# EAGLE schematic m220pal (EAGLE 4.11)
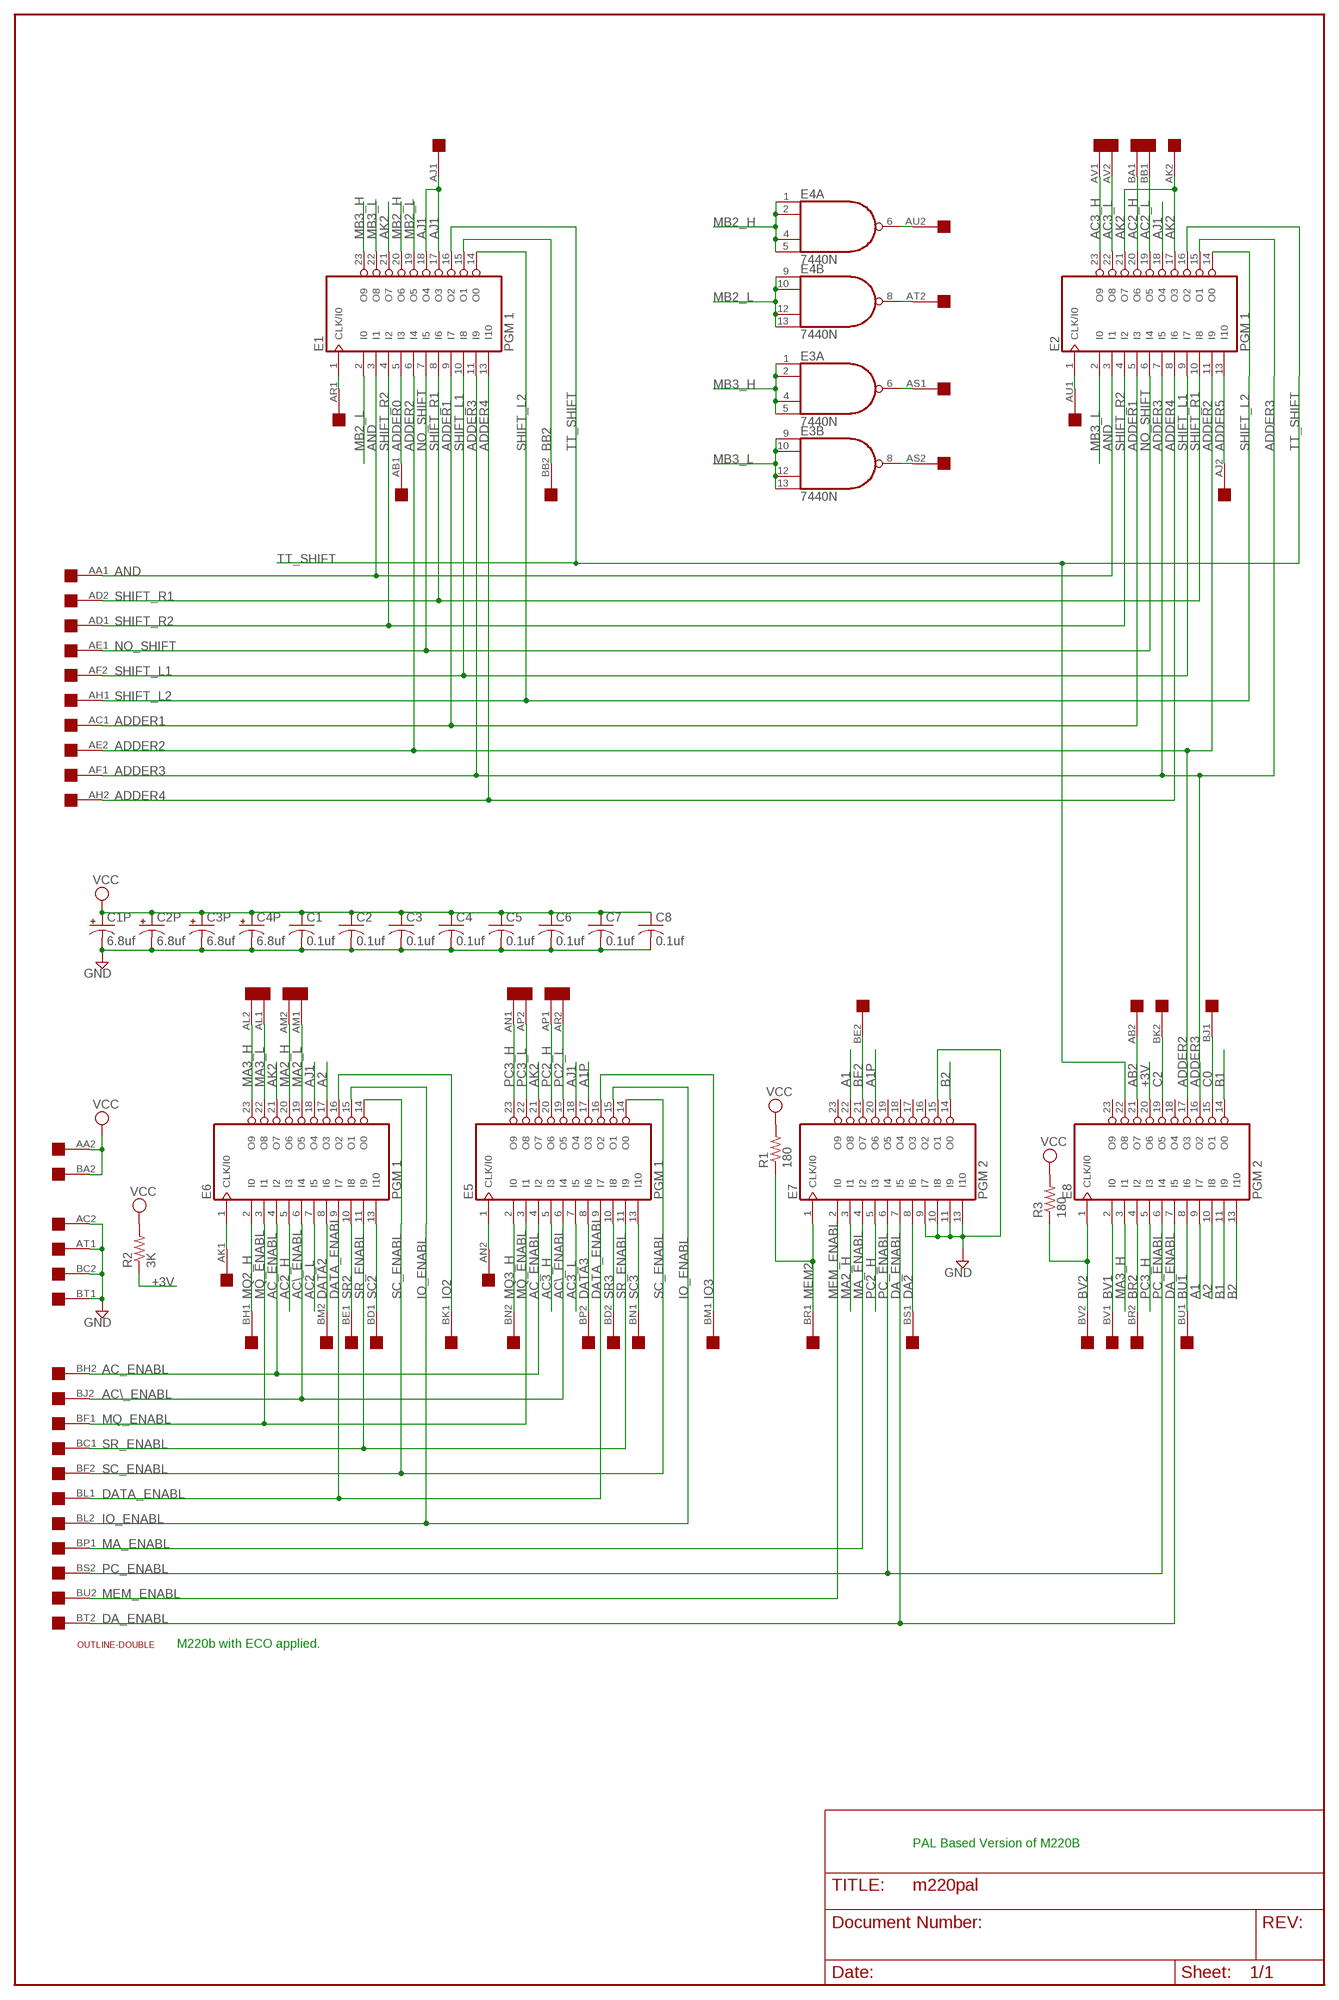
[diagram p0: schematic, sheet 1]

## Parts
C1  0.1uf  C-US050-025X075  [C050-025X075]
C1P  6.8uf  CPOL-USE15-5AXIAL  [E15-5]
C2  0.1uf  C-US050-025X075  [C050-025X075]
C2P  6.8uf  CPOL-USE15-5AXIAL  [E15-5]
C3  0.1uf  C-US050-025X075  [C050-025X075]
C3P  6.8uf  CPOL-USE15-5AXIAL  [E15-5]
C4  0.1uf  C-US050-025X075  [C050-025X075]
C4P  6.8uf  CPOL-USE15-5AXIAL  [E15-5]
C5  0.1uf  C-US050-025X075  [C050-025X075]
C6  0.1uf  C-US050-025X075  [C050-025X075]
C7  0.1uf  C-US050-025X075  [C050-025X075]
C8  0.1uf  C-US050-025X075  [C050-025X075]
E1  PGM 1  22V10  [DIL24-3]
E2  PGM 1  22V10  [DIL24-3]
E3  7440N  74S20N  [DIL14]
E4  7440N  74S20N  [DIL14]
E5  PGM 1  22V10  [DIL24-3]
E6  PGM 1  22V10  [DIL24-3]
E7  PGM 2  22V10  [DIL24-3]
E8  PGM 2  22V10  [DIL24-3]
R1  180  R-US_0207/10  [0207/10]
R2  3K  R-US_0207/10  [0207/10]
R3  180  R-US_0207/10  [0207/10]
U$1  DOUBLE  [EDGE-CON4]
U$2  OUTLINE-DOUBLE  [DOUBLE]

## Nets
+3V: E8.20(O6) R2.1
A1: E7.22(O8) E8.9(I7)
A1P: E5.17(O3) E7.20(O6)
A2: E6.17(O3) E8.10(I8)
AB2: E8.21(O7) U$1.AB2
AC2_H: E2.20(O6) E6.5(I3) U$1.BA1
AC2_L: E2.19(O5) E6.7(I5) U$1.BB1
AC3_H: E2.23(O9) E5.5(I3) U$1.AV1
AC3_L: E2.22(O8) E5.7(I5) U$1.AV2
AC\_ENABL: E5.6(I4) E6.6(I4) U$1.BJ2
AC_ENABL: E5.4(I2) E6.4(I2) U$1.BH2
ADDER0: E1.5(I3) U$1.AB1
ADDER1: E1.9(I7) E2.5(I3) U$1.AC1
ADDER2: E1.6(I4) E2.11(I9) E8.17(O3) U$1.AE2
ADDER3: E1.11(I9) E2.7(I5) E2.15(O1) E8.16(O2) U$1.AF1
ADDER4: E1.13(I10) E2.8(I6) U$1.AH2
ADDER5: E2.13(I10) U$1.AJ2
AJ1: E1.17(O3) E1.18(O4) E2.18(O4) E5.18(O4) E6.18(O4) U$1.AJ1
AK2: E1.21(O7) E2.17(O3) E2.21(O7) E5.21(O7) E6.21(O7) U$1.AK2
AND: E1.3(I1) E2.3(I1) U$1.AA1
AS1: E3.6(A:O) U$1.AS1
AS2: E3.8(B:O) U$1.AS2
AT2: E4.8(B:O) U$1.AT2
AU2: E4.6(A:O) U$1.AU2
B1: E8.11(I9) E8.14(O0)
B2: E7.14(O0) E8.13(I10)
BB2: E1.15(O1) U$1.BB2
BE2: E7.21(O7) U$1.BE2
BR2: E8.4(I2) U$1.BR2
BU1: E8.8(I6) U$1.BU1
BV1: E8.2(I0) U$1.BV1
BV2: E8.1(CLK/I0) R3.1 U$1.BV2
C0: E8.15(O1) U$1.BJ1
C2: E8.19(O5) U$1.BK2
DA2: E7.8(I6) U$1.BS1
DA_ENABL: E7.7(I5) E8.7(I5) U$1.BT2
DATA2: E6.8(I6) U$1.BM2
DATA3: E5.8(I6) U$1.BP2
DATA_ENABL: E5.9(I7) E6.9(I7) U$1.BL1
GND [Supply]: C1.2 C1P.- C2.2 C2P.- C3.2 C3P.- C4.2 C4P.- C5.2 C6.2 C7.2 C8.2 E7.9(I7) E7.10(I8) E7.11(I9) E7.13(I10) E7.15(O1) U$1.AC2 U$1.AT1 U$1.BC2 U$1.BT1
IO2: E6.16(O2) U$1.BK1
IO3: E5.16(O2) U$1.BM1
IO_ENABL: E5.15(O1) E6.15(O1) U$1.BL2
MA2_H: E6.20(O6) E7.3(I1) U$1.AM2
MA2_L: E6.19(O5) U$1.AM1
MA3_H: E6.23(O9) E8.3(I1) U$1.AL2
MA3_L: E6.22(O8) U$1.AL1
MA_ENABL: E7.4(I2) U$1.BP1
MB2_H: E1.20(O6) E4.1(A:I0) E4.2(A:I1) E4.4(A:I2) E4.5(A:I3)
MB2_L: E1.2(I0) E1.19(O5) E4.9(B:I0) E4.10(B:I1) E4.12(B:I2) E4.13(B:I3)
MB3_H: E1.23(O9) E3.1(A:I0) E3.2(A:I1) E3.4(A:I2) E3.5(A:I3)
MB3_L: E1.22(O8) E2.2(I0) E3.9(B:I0) E3.10(B:I1) E3.12(B:I2) E3.13(B:I3)
MEM2: E7.1(CLK/I0) R1.1 U$1.BR1
MEM_ENABL: E7.2(I0) U$1.BU2
MQ2_H: E6.2(I0) U$1.BH1
MQ3_H: E5.2(I0) U$1.BN2
MQ_ENABL: E5.3(I1) E6.3(I1) U$1.BF1
N$1: E6.1(CLK/I0) U$1.AK1
N$2: E5.1(CLK/I0) U$1.AN2
N$3: E1.1(CLK/I0) U$1.AR1
N$4: E2.1(CLK/I0) U$1.AU1
NO_SHIFT: E1.7(I5) E2.6(I4) U$1.AE1
PC2_H: E5.20(O6) E7.5(I3) U$1.AP1
PC2_L: E5.19(O5) U$1.AR2
PC3_H: E5.23(O9) E8.5(I3) U$1.AN1
PC3_L: E5.22(O8) U$1.AP2
PC_ENABL: E7.6(I4) E8.6(I4) U$1.BS2
SC2: E6.13(I10) U$1.BD1
SC3: E5.13(I10) U$1.BN1
SC_ENABL: E5.14(O0) E6.14(O0) U$1.BF2
SHIFT_L1: E1.10(I8) E2.9(I7) U$1.AF2
SHIFT_L2: E1.14(O0) E2.14(O0) U$1.AH1
SHIFT_R1: E1.8(I6) E2.10(I8) U$1.AD2
SHIFT_R2: E1.4(I2) E2.4(I2) U$1.AD1
SR2: E6.10(I8) U$1.BE1
SR3: E5.10(I8) U$1.BD2
SR_ENABL: E5.11(I9) E6.11(I9) U$1.BC1
TT_SHIFT: E1.16(O2) E2.16(O2) E8.22(O8)
VCC [Supply]: C1.1 C1P.+ C2.1 C2P.+ C3.1 C3P.+ C4.1 C4P.+ C5.1 C6.1 C7.1 C8.1 R1.2 R2.2 R3.2 U$1.AA2 U$1.BA2
Unconnected: E7.16(O2) E7.17(O3) E7.18(O4) E7.19(O5) E7.23(O9) E8.18(O4) E8.23(O9)

## Notes on the sheet
- M220b with ECO applied.
- PAL Based Version of M220B

## Power pins joined to a net without a drawn wire
GND: E1.12(GND) E2.12(GND) E3.7(P:GND) E4.7(P:GND) E5.12(GND) E6.12(GND) E7.12(GND) E8.12(GND)
VCC: E1.24(VCC) E2.24(VCC) E3.14(P:VCC) E4.14(P:VCC) E5.24(VCC) E6.24(VCC) E7.24(VCC) E8.24(VCC)

## Library data of the parts
C1-C8 = rcl:C-US: CAPACITOR, American symbol
C1P C2P C3P C4P = rcl:CPOL-US: POLARIZED CAPACITOR, American symbol
E1 E2 E5-E8 = pal:22V10: PAL
E3 E4 = 74xx-jameco:74*20: Dual 4-input NAND gate
R1-R3 = rcl:R-US_: RESISTOR, American symbol
U$1 = dec-con:DOUBLE: Double-Height DEC board
U$2 = dec-con:OUTLINE-*: Board outlines for DEC boards.

## Net classes
1 Supply: width 0.813 mm